# EAGLE design AUGER CONTROL BOARD (EAGLE 9.3.0)
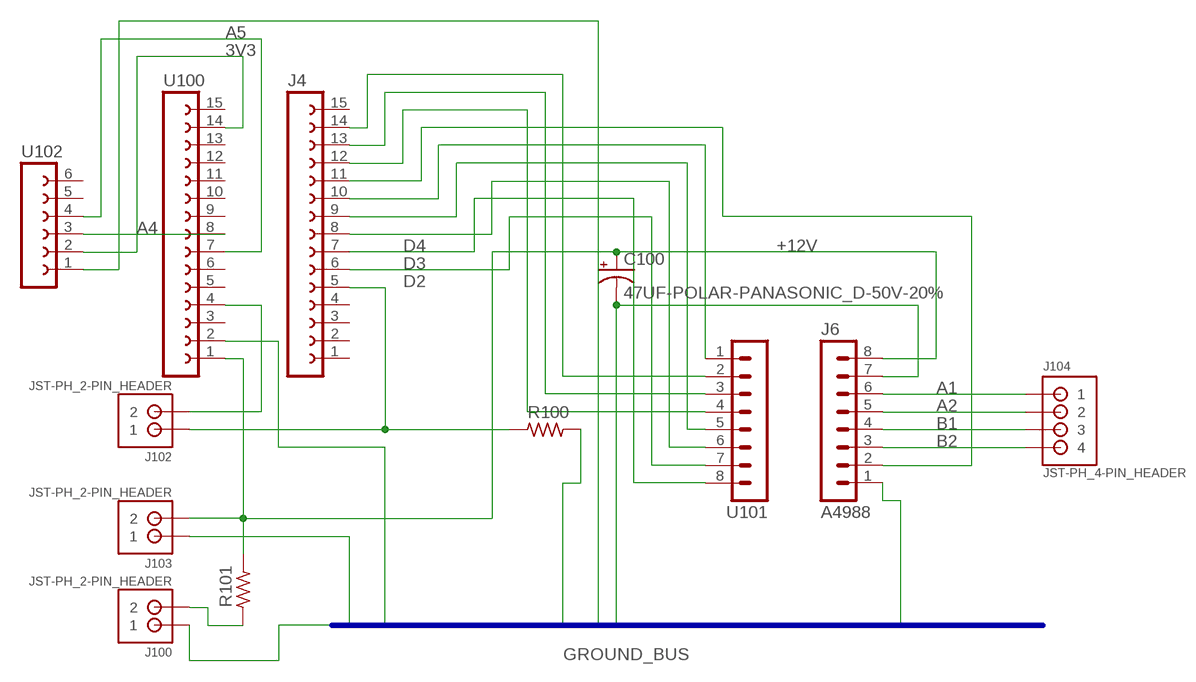
[diagram p0: schematic, sheet 1]

## Parts
C100  47UF-POLAR-PANASONIC_D-50V-20%  [PANASONIC_D]
J4  FE15-1  [FE15]
J6  A4988  MA08-1  [MA08-1]
J100  JST-PH_2-PIN_HEADER  [JST_B2B-PH_HEADER]
J102  JST-PH_2-PIN_HEADER  [JST_B2B-PH_HEADER]
J103  JST-PH_2-PIN_HEADER  [JST_B2B-PH_HEADER]
J104  JST-PH_4-PIN_HEADER  [JST_B4B-PH_HEADER]
R100  R_5025  [R5025]
R101  R_5025  [R5025]
U100  FE15-1  [FE15]
U101  MA08-1  [MA08-1]
U102  FE06-1  [FE06]

## Nets
3V3: U100.14 U102.2
+12V: C100.+ J6.8 J103.P2 R101.2 U100.1
A1: J6.6 J104.P1
A2: J6.5 J104.P2
A4: U100.8 U102.3
A5: U100.7 U102.4
B1: J6.4 J104.P3
B2: J6.3 J104.P4
D2: J4.5 J102.P1 R100.1
D3: J4.6 U101.7
D4: J4.7 U101.8
GROUND_BUS: C100.- J6.1 J6.7 J100.P1 J103.P1 R100.2 U100.2 U102.1
LOGIC_V+: J102.P2 U100.4
N$1: J4.8 U101.6
N$2: J4.9 U101.5
N$3: J4.11 J6.2
N$4: J4.10 U101.1
N$6: J4.12 U101.4
N$7: J4.13 U101.3
N$9: J4.14 U101.2
N$12: J100.P2 R101.1
Unconnected: J4.1 J4.2 J4.3 J4.4 J4.15 U100.3 U100.5 U100.6 U100.9 U100.10 U100.11 U100.12 U100.13 U100.15 U102.5 U102.6

## Buses
GROUND_BUS

## Library data of the parts
C100 = SparkFun-Capacitors:47UF-POLAR: 47µF polarized capacitors A capacitor is a passive two-terminal electrical component used to store electrical energy temporarily in an electric field.
J4 U100 = con-lsta:FE15-1: FEMALE HEADER; OC_FARNELL: unknown; OC_NEWARK: unknown
J6 U101 = con-lstb:MA08-1: PIN HEADER; OC_FARNELL: unknown; OC_NEWARK: unknown
J100 J102 J103 = SRG:JST-PH_2-PIN_HEADER: 2-pin JST PH Shrouded Header, top entry P/N B2B-PH-K-S Mating connector PHR-2 Mating cable assembly: Sparkfun PRT-09914 <http://www.sparkfun.com/products/9914>
J104 = SRG:JST-PH_4-PIN_HEADER: 4-pin JST PH Shrouded Header, top entry P/N B4B-PH-K-S Mating connector PHR-4 Mating cable assembly: Sparkfun PRT-09916 <http://www.sparkfun.com/products/9916>
R100 R101 = rc-master-smd:R_: RESISTOR
U102 = con-lsta A:FE06-1: FEMALE HEADER; OC_FARNELL: unknown; OC_NEWARK: unknown

## Board
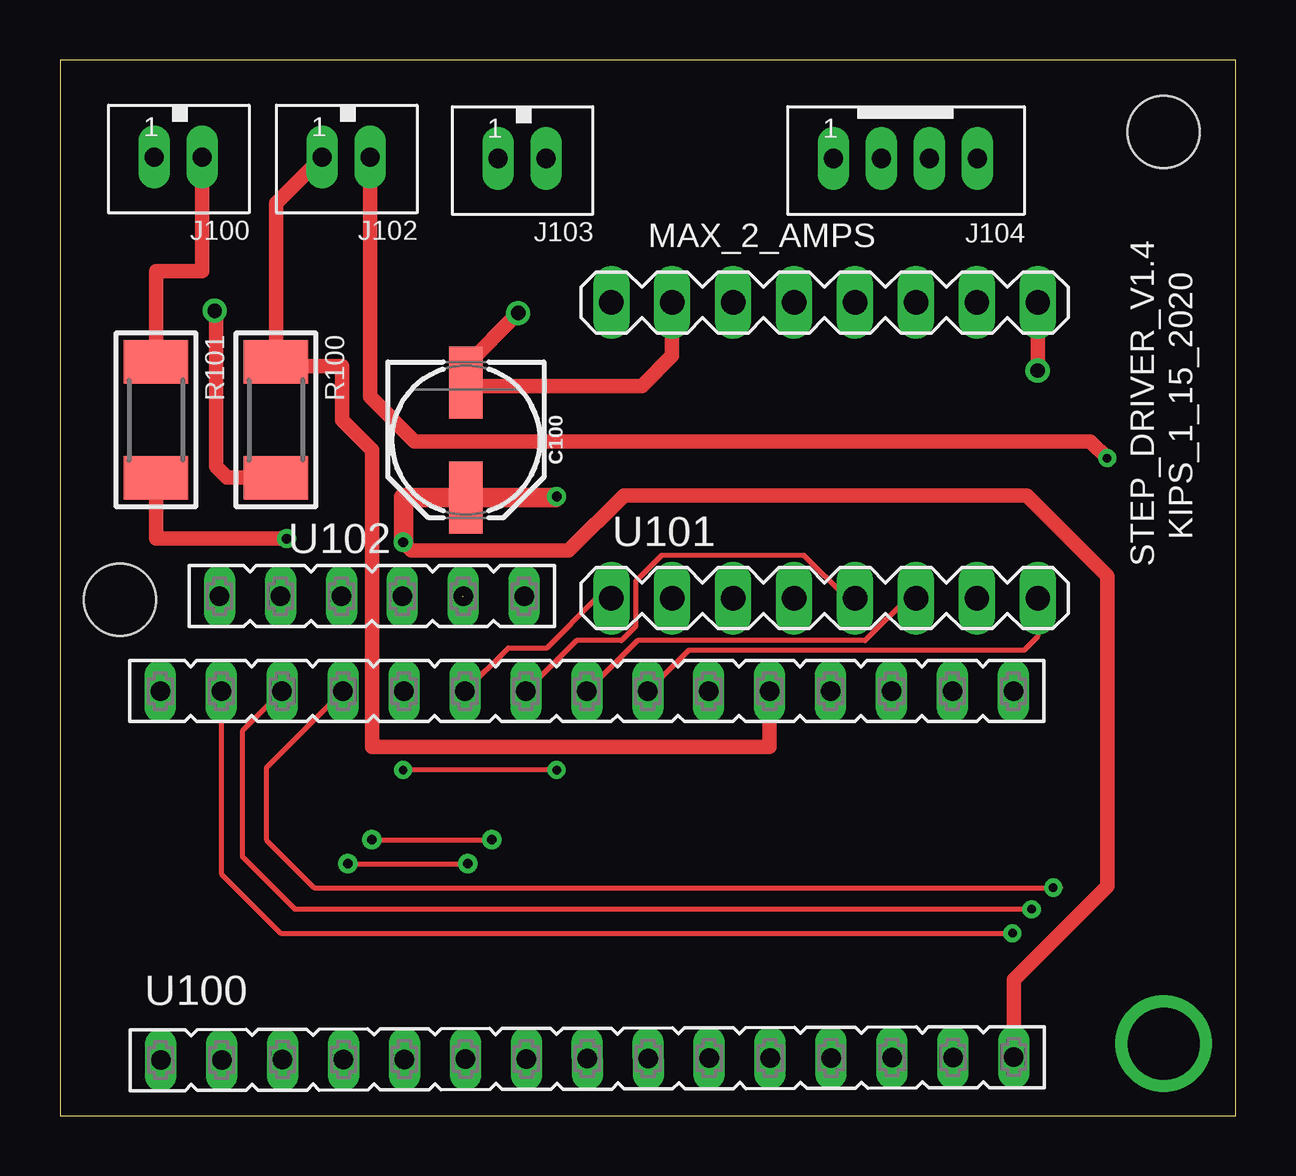
[diagram p1: board, top side]
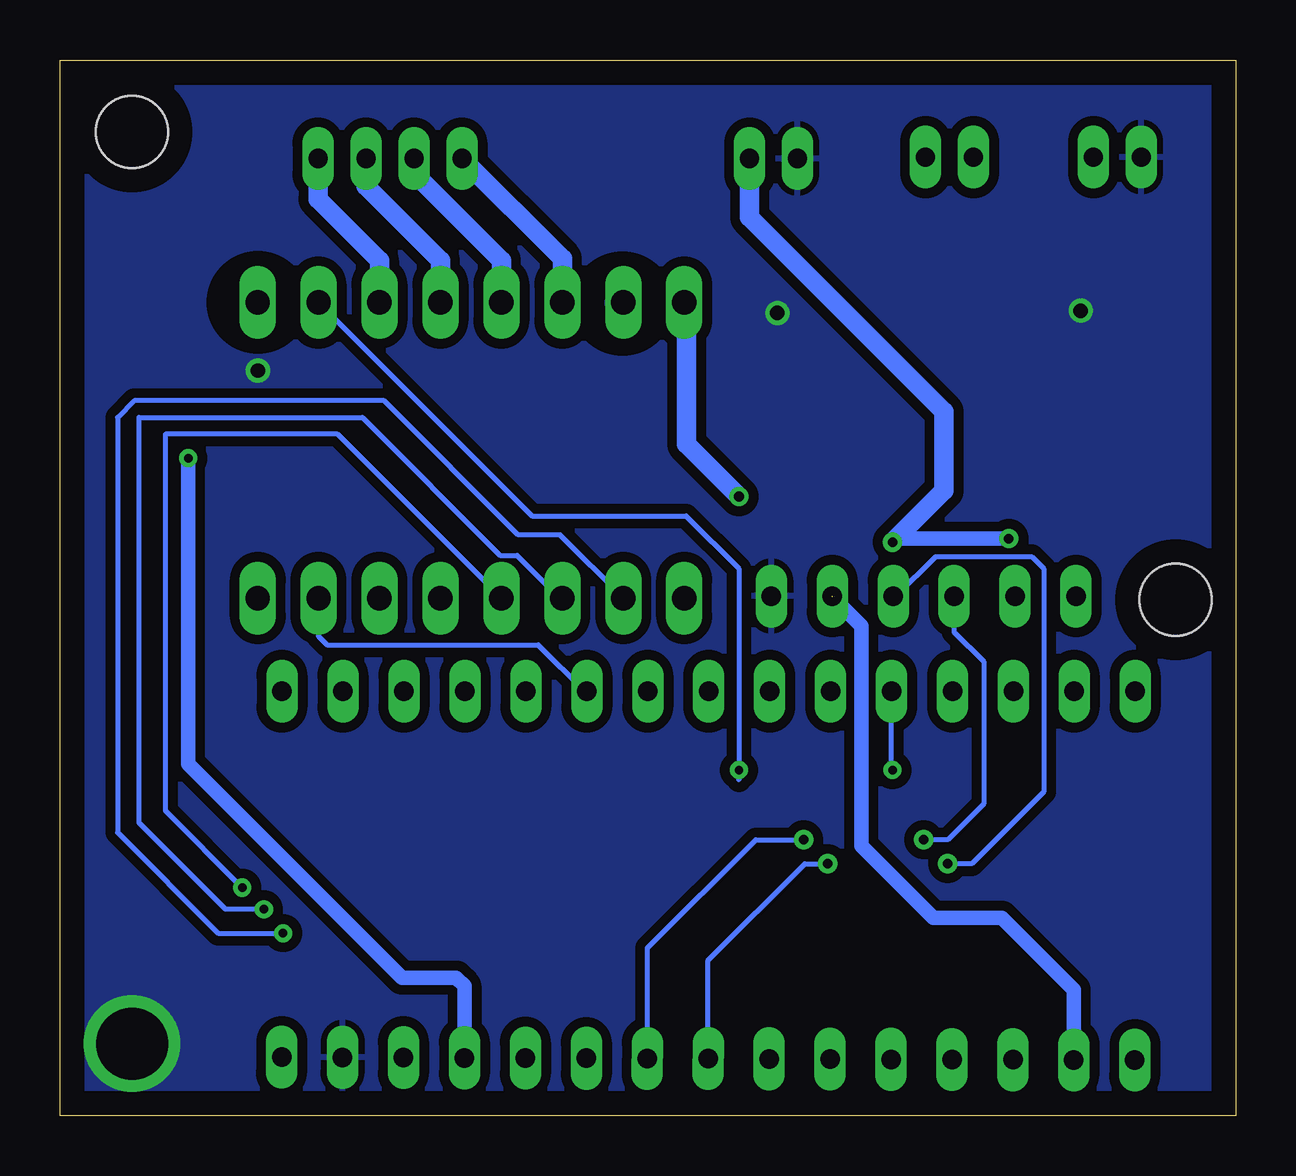
[diagram p2: board, bottom side, seen from below]

Size 49 x 44 mm. Coordinates in mm from the lower left corner, seen from the top.
Outline: 0,0 49,0 49,44 0,44 0,0
Copper layers (1*16): Top 0.035mm / dielectric 1.5mm / Bottom 0.035mm
Design rules "default": minimum track width 6mil, minimum drill 0.35mm, track to track 6mil, track to pad 6mil, pad to pad 6mil, via to via 6mil, smd to smd 6mil, copper to edge 40mil, drill to drill 6mil, minimum pad ring 10mil, minimum via ring 8mil, stop-mask expansion 4mil, vias tented up to drill 0mil, thermal gap 10mil
Holes 3 mm at 46,41 2.5,21.5
bRestrict: area 39.3,32.5 to 42.2,35.3; area 24.1,32.4 to 27,35.3

### Footprints (pad centres in the part's own frame; a part is rotated, then mirrored left to right if it is on the bottom)
PANASONIC_D = smd 3 x 1.4: + 2.4,0; - -2.4,0
FE15 = drill 0.813 long: 1 -17.78,0; 2 -15.24,0; 3 -12.7,0; 4 -10.16,0; 5 -7.62,0; 6 -5.08,0; 7 -2.54,0; 8 0,0; 9 2.54,0; 10 5.08,0; 11 7.62,0; 12 10.16,0; 13 12.7,0; 14 15.24,0; 15 17.78,0
MA08-1 = drill 1.016 long: 1 -8.89,0; 2 -6.35,0; 3 -3.81,0; 4 -1.27,0; 5 1.27,0; 6 3.81,0; 7 6.35,0; 8 8.89,0
JST_B2B-PH_HEADER = drill 0.8 long: P1 1.075,0.048; P2 -0.925,0.048
JST_B4B-PH_HEADER = drill 0.8 long: P1 2.98,0.048; P2 0.98,0.048; P3 -1.02,0.048; P4 -3.02,0.048
R5025 = smd 1.8 x 2.7: 1 -2.413,0; 2 2.413,0
FE06 = drill 0.813 long: 1 -6.35,0; 2 -3.81,0; 3 -1.27,0; 4 1.27,0; 5 3.81,0; 6 6.35,0

### Placement (x,y rotation side)
C100  16.92,28.16 270 top
J4  21.96,17.69 180 top
J6  31.87,33.89 180 top
J100  5,40 180 top
J102  12,40 180 top
J103  19.33,39.94 180 top
J104  35.22,39.94 180 top
R100  9,29 270 top
R101  4,29 270 top
U100  21.98,2.37 180.2 top
U101  31.87,21.57 0 top
U102  13,21.65 180 top

### Tracks (layer width: path | path; a pad name or v marks a point on that pad's centre or on a via)
3V3  (1 unrouted)
  Bottom 0.61: 6.74,3.57 U100.14 6.74,5.24 9.75,8.25 12.6,8.25 15.6,11.25 15.6,20.4 16.81,21.61
+12V  (via drill 0.4)
  Top 0.61: v20.7,25.8 20.65,25.75 | v9.45,24.05 4,24.05 R101.2 | U100.1 39.75,2.44 39.75,5.65 43.65,9.55 43.65,22.5 40.3,25.85 23.5,25.85 21.2,23.55 14.65,23.55 v14.3,23.9
  Top 0.751: 14.32,23.9 v14.3,23.9
  Top 0.813: 20.65,25.75 C100.+ 14.32,25.76 14.32,23.9
  Bottom 0.61: v9.45,24.05 14.15,24.05 v14.3,23.9
  Bottom 0.813: 20.25,40.19 J103.P2 20.25,37.44 12.15,29.34 12.15,26.05 v14.3,23.9 | v20.7,25.8 22.88,27.98 22.88,33.79 J6.8
A1
  Bottom 0.813: J104.P1 28.06,35.71 J6.6
A2
  Bottom 0.813: J104.P2 34.24,39.28 30.6,35.64 J6.5
A4  (via drill 0.4)
  Top 0.2: v12,10.5 v17,10.5
  Bottom 0.2: U102.3 14.15,21.65 12.5,23.3 8.5,23.3 8,22.8 8,13.5 11,10.5 v12,10.5 | U100.8 21.98,6.47 17.95,10.5 v17,10.5
A5  (via drill 0.4)
  Top 0.2: v13,11.5 v18,11.5
  Bottom 0.2: U102.4 11.73,20.15 10.5,18.92 10.5,13 12,11.5 v13,11.5 | U100.7 24.52,6.98 20,11.5 v18,11.5
B1
  Bottom 0.813: J6.4 33.14,35.64 36.24,38.74 J104.P3
B2
  Bottom 0.813: J104.P4 38.24,38.2 35.68,35.64 J6.3
D2
  Top 0.61: J102.P1 9,38.03 R100.1 9,31.25 11.75,31.25 11.75,29 13.01,27.75 13.01,15.36 29.58,15.36 J4.5
D3
  Bottom 0.2: J4.6 27.14,17.69 29.07,19.62 37.87,19.62 38.22,19.97 U101.7
D4
  Top 0.2: U101.8 40.76,19.97 40.18,19.39 26.2,19.39 J4.7
GROUND_BUS  (via drill 0.6, 3)
  Top 0.61: 3.98,39.9 J100.P1 | R100.2 6.96,26.59 6.5,27.05 6.5,33.5 v6.45,33.55 | J6.7 25.52,31.67 24.25,30.4 17.08,30.4 C100.- 16.92,31.27 v19.1,33.45 | J6.1 v40.76,31.06 v40.75,31.05
  other vias: 46,3
  pour Bottom (isolate 0.406): -0.2,44.1 -0.2,-0.35 49.2,-0.35 49.35,-0.2 49.35,44.25 -0.05,44.25
LOGIC_V+  (via drill 0.35)
  Top 0.61: J102.P2 12.93,29.96 14.78,28.1 42.95,28.1 v43.65,27.4
  Bottom 0.61: U100.4 32.14,5.41 32.48,5.75 34.75,5.75 43.65,14.65 v43.65,27.4
N$1
  Top 0.2: U101.6 35.34,21.57 33.56,19.79 24.06,19.79 J4.8
N$2
  Top 0.2: U101.5 32.8,21.57 31.02,23.35 25.08,23.35 23.99,22.26 23.99,20.39 23.4,19.79 21.52,19.79 J4.9
N$3  (via drill 0.35)
  Top 0.2: v20.7,14.4 v14.3,14.4
  Bottom 0.2: J6.2 29.33,25 22.9,25 20.7,22.8 v20.7,14.4 20.7,14 | v14.3,14.4 14.34,14.44 J4.11
N$4
  Top 0.2: J4.10 18.69,19.5 20.3,19.5 22.37,21.57 U101.1
N$6  (via drill 0.35)
  Top 0.2: J4.12 8.6,14.49 8.6,11.5 10.6,9.5 v41.4,9.5 41.7,9.5
  Bottom 0.2: U101.4 37.43,28.4 44.6,28.4 44.6,12.7 v41.4,9.5
N$7  (via drill 0.35)
  Top 0.2: J4.13 7.6,16.03 7.6,10.8 9.8,8.6 v40.5,8.6
  Bottom 0.2: v40.5,8.6 42.1,8.6 45.7,12.2 45.7,29.09 36.39,29.09 30.65,23.35 29.95,23.35 28.17,21.57 U101.3
N$9  (via drill 0.35)
  Top 0.2: J4.14 6.72,10.08 9.2,7.6 v39.7,7.6
  Bottom 0.2: U101.2 28.15,24.2 29.9,24.2 35.5,29.8 45.9,29.8 46.6,29.1 46.6,11.8 42.4,7.6 v39.7,7.6
N$12
  Top 0.61: R101.1 4,35.2 5.92,35.2 J100.P2

### Text on the board
tNames: MAX_2_AMPS | KIPS_1_15_2020 | STEP_DRIVER_V1.4